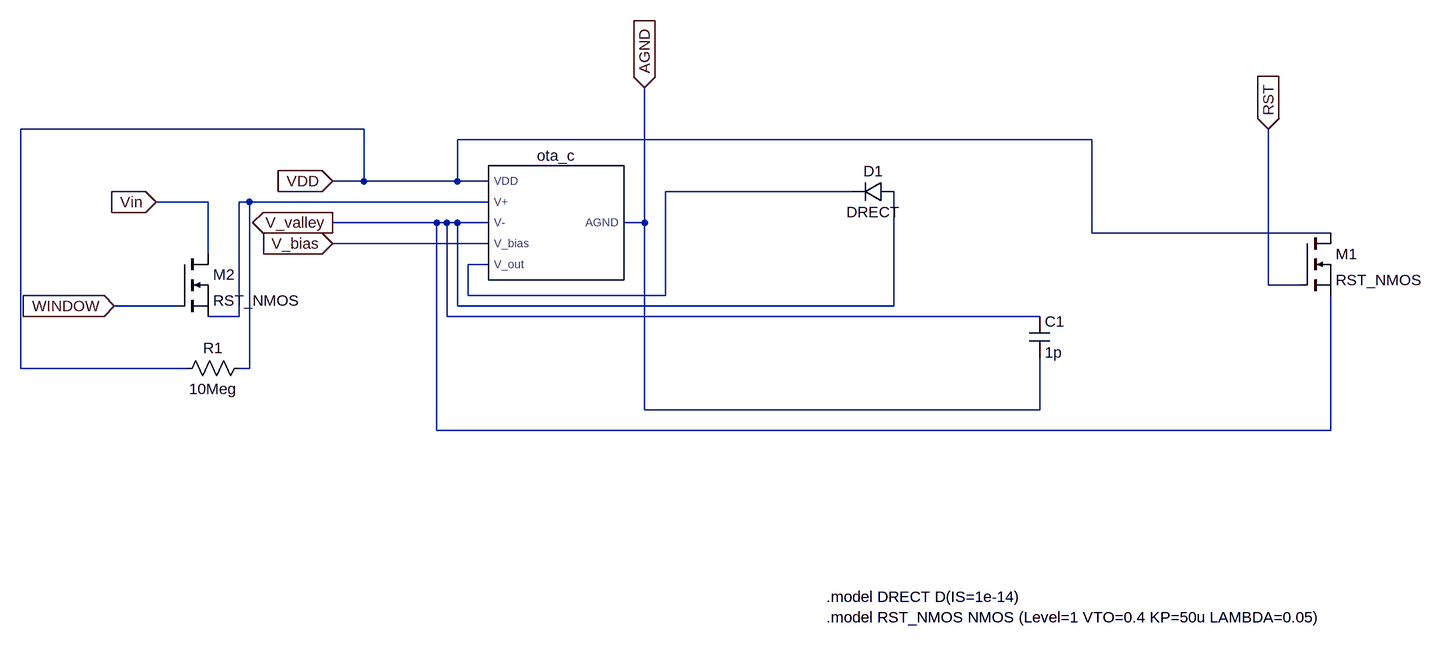
[diagram p0: schematic gated_valley.asc]
gated_valley.asc, the LTspice schematic file:
Version 4.1
SHEET 1 1532 780
WIRE -96 16 -624 16
WIRE 1024 32 48 32
WIRE -96 96 -96 16
WIRE -96 96 -144 96
WIRE 48 96 48 32
WIRE 48 96 -96 96
WIRE 96 96 48 96
WIRE 656 112 368 112
WIRE -336 128 -416 128
WIRE -272 128 -288 128
WIRE 96 128 -272 128
WIRE 16 160 -144 160
WIRE 32 160 16 160
WIRE 48 160 32 160
WIRE 96 160 48 160
WIRE 336 160 336 -48
WIRE 336 160 304 160
WIRE 1024 176 1024 32
WIRE 1392 176 1024 176
WIRE 96 192 -144 192
WIRE -336 208 -336 128
WIRE 96 224 64 224
WIRE 1296 256 1296 16
WIRE 1344 256 1296 256
WIRE 64 272 64 224
WIRE 368 272 368 112
WIRE 368 272 64 272
WIRE -384 288 -480 288
WIRE 48 288 48 160
WIRE 720 288 720 112
WIRE 720 288 48 288
WIRE -288 304 -288 128
WIRE -288 304 -336 304
WIRE 32 304 32 160
WIRE 944 304 32 304
WIRE -624 384 -624 16
WIRE -368 384 -624 384
WIRE -272 384 -272 128
WIRE -272 384 -288 384
WIRE 336 448 336 160
WIRE 944 448 944 368
WIRE 944 448 336 448
WIRE 16 480 16 160
WIRE 1392 480 1392 272
WIRE 1392 480 16 480
FLAG -144 96 VDD
IOPIN -144 96 In
FLAG -144 160 V_valley
IOPIN -144 160 Out
FLAG -144 192 V_bias
IOPIN -144 192 In
FLAG 336 -48 AGND
IOPIN 336 -48 In
FLAG 1296 16 RST
IOPIN 1296 16 In
FLAG -416 128 Vin
IOPIN -416 128 In
FLAG -480 288 WINDOW
IOPIN -480 288 In
SYMBOL ota_core 192 160 R0
SYMATTR InstName ota_c
SYMBOL diode 720 96 R90
WINDOW 0 0 32 VBottom 2
WINDOW 3 32 32 VTop 2
SYMATTR InstName D1
SYMATTR Value DRECT
SYMBOL cap 928 304 R0
SYMATTR InstName C1
SYMATTR Value 1p
SYMBOL nmos 1344 176 R0
SYMATTR InstName M1
SYMATTR Value RST_NMOS
SYMBOL nmos -384 208 R0
SYMATTR InstName M2
SYMATTR Value RST_NMOS
SYMBOL res -272 368 R90
WINDOW 0 0 56 VBottom 2
WINDOW 3 32 56 VTop 2
SYMATTR InstName R1
SYMATTR Value 10Meg
TEXT 616 736 Left 2 !.model DRECT D(IS=1e-14)\n.model RST_NMOS NMOS (Level=1 VTO=0.4 KP=50u LAMBDA=0.05)

The netlist it stands for:
* gated_valley.asc
X§ota_c VDD N002 V_valley V_bias N001 AGND ota_core  ; pins VDD V+ V- V_bias V_out AGND
D1 V_valley N001 DRECT
C1 V_valley AGND 1p
M1 VDD RST V_valley V_valley RST_NMOS
M2 Vin WINDOW N002 N002 RST_NMOS
R1 N002 VDD 10Meg
.model D D
.lib standard.dio
.model NMOS NMOS
.model PMOS PMOS
.lib standard.mos
.model DRECT D(IS=1e-14)
.model RST_NMOS NMOS (Level=1 VTO=0.4 KP=50u LAMBDA=0.05)
.backanno
.end